# EAGLE design DiceMC-V1.0 (EAGLE 7.7.0)
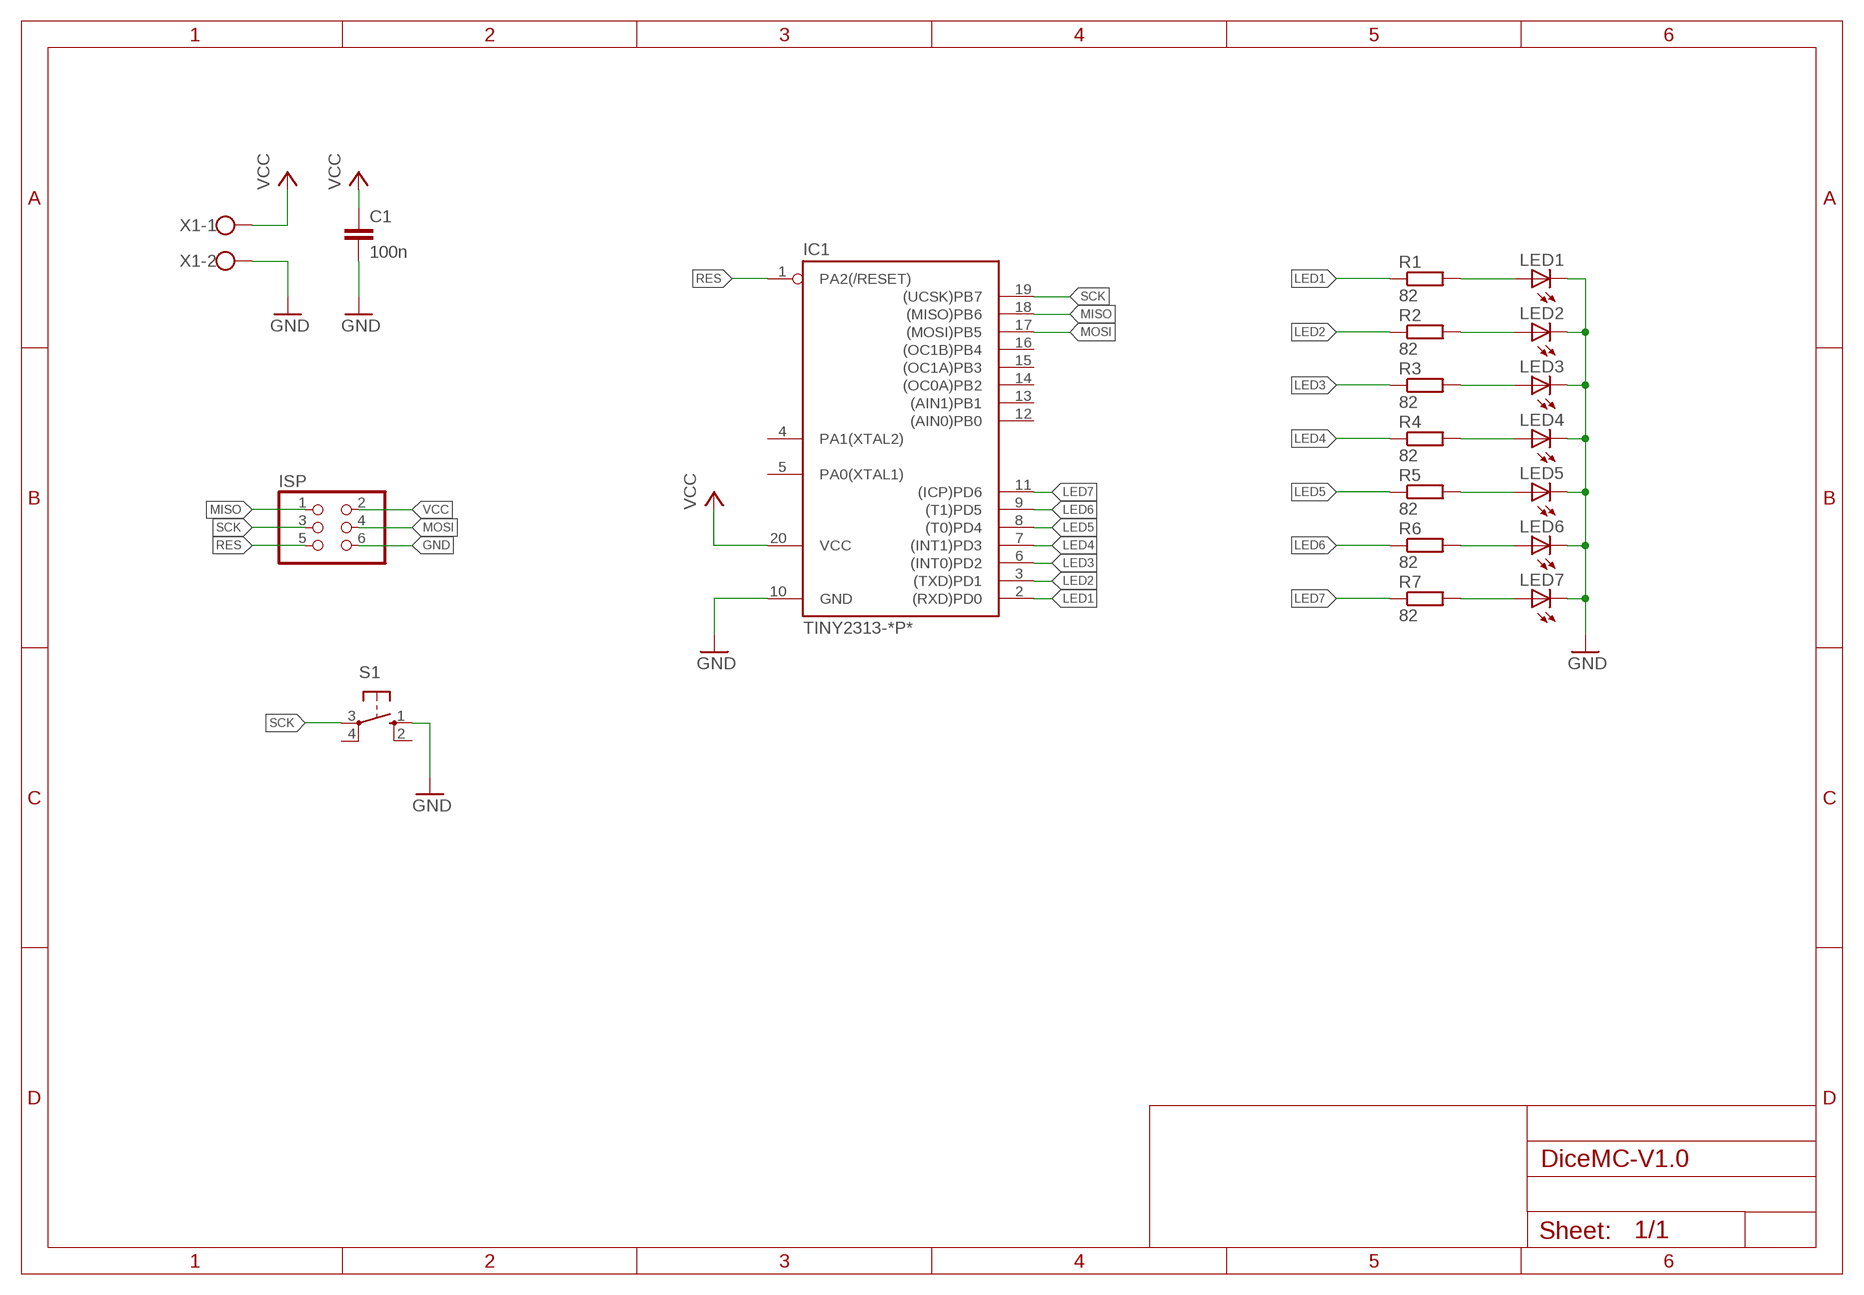
[diagram p0: schematic, sheet 1]

## Parts
C1  100n  C-EU025-025X050  [C025-025X050]
IC1  TINY2313-*P*  [DIL20]
ISP  PINHD-2X03_2.54  [2X03]
LED1  LED5MM  [LED5MM]
LED2  LED5MM  [LED5MM]
LED3  LED5MM  [LED5MM]
LED4  LED5MM  [LED5MM]
LED5  LED5MM  [LED5MM]
LED6  LED5MM  [LED5MM]
LED7  LED5MM  [LED5MM]
R1  82  R-EU_0207/7  [0207/7]
R2  82  R-EU_0207/7  [0207/7]
R3  82  R-EU_0207/7  [0207/7]
R4  82  R-EU_0207/7  [0207/7]
R5  82  R-EU_0207/7  [0207/7]
R6  82  R-EU_0207/7  [0207/7]
R7  82  R-EU_0207/7  [0207/7]
S1  10-XX  [B3F-10XX]
X1  W237-102  [W237-102]

## Nets
GND: C1.2 IC1.10(GND) ISP.6 LED1.K(C) LED2.K(C) LED3.K(C) LED4.K(C) LED5.K(C) LED6.K(C) LED7.K(C) S1.1(S) X1.2
LED1: IC1.2((RXD)PD0) R1.1
LED2: IC1.3((TXD)PD1) R2.1
LED3: IC1.6((INT0)PD2) R3.1
LED4: IC1.7((INT1)PD3) R4.1
LED5: IC1.8((T0)PD4) R5.1
LED6: IC1.9((T1)PD5) R6.1
LED7: IC1.11((ICP)PD6) R7.1
MISO: IC1.18((MISO)PB6) ISP.1
MOSI: IC1.17((MOSI)PB5) ISP.4
N$1: LED1.A R1.2
N$2: LED2.A R2.2
N$3: LED3.A R3.2
N$4: LED4.A R4.2
N$5: LED5.A R5.2
N$6: LED6.A R6.2
N$7: LED7.A R7.2
RES: IC1.1(PA2(/RESET)) ISP.5
SCK: IC1.19((UCSK)PB7) ISP.3 S1.3(P)
VCC: C1.1 IC1.20(VCC) ISP.2 X1.1
Unconnected: IC1.4(PA1(XTAL2)) IC1.5(PA0(XTAL1)) IC1.12((AIN0)PB0) IC1.13((AIN1)PB1) IC1.14((OC0A)PB2) IC1.15((OC1A)PB3) IC1.16((OC1B)PB4) S1.2(S1) S1.4(P1)

## Library data of the parts
C1 = rcl:C-EU: CAPACITOR, European symbol
IC1 = avr-7:TINY2313*: Atmel Tiny2313 2K Flash, 128 bytes EEPROM, 128 bytes RAM
ISP = pinhead-2:PINHD-2X03: PIN HEADER
LED1-LED7 = led:LED: LED OSRAM: - CHIPLED LG R971, LG N971, LY N971, LG Q971, LY Q971, LO R971, LY R971 LH N974, LH R974 LS Q976, LO Q976, LY Q976 LO Q996 - Hyper CHIPLED LW Q18S LB Q993, LB Q99A, LB R99A - SideLED LS A670, LO A670, LY A670, LG A670, LP A670 LB A673, LV A673, LT A673, LW A673 LH A674 LY A675 LS A676, LA A676, LO A676, LY A676, LW A676 LS A679, LY A679, LG A679 - Hyper Micro SIDELED® LS Y876, LA Y876, LO Y876, LY Y876 LT Y87S - SmartLED LW L88C, LW L88S LB L89C, LB L89S, LG L890 LS L89K, LO L89K, LY L89K LS L896, LA L896, LO L896, LY L896 - TOPLED LS T670, LO T670, LY T670, LG T670, LP T670 LSG T670, LSP T670, LSY T670, LOP T670, LYG T670 LG T671, LOG T671, LSG T671 LB T673, LV T673, LT T673, LW T673 LH T674 LS T676, LA T676, LO T676, LY T676, LB T676, LH T676, LSB T676, LW T676 LB T67C, LV T67C, LT T67C, LS T67K, LO T67K, LY T67K, LW E67C LS E67B, LA E67B, LO E67B, LY E67B, LB E67C, LV E67C, LT E67C LW T67C LS T679, LY T679, LG T679 LS T770, LO T770, LY T770, LG T770, LP T770 LB T773, LV T773, LT T773, LW T773 LH T774 LS E675, LA E675, LY E675, LS T675 LS T776, LA T776, LO T776, LY T776, LB T776 LHGB T686 LT T68C, LB T68C - Hyper Mini TOPLED® LB M676 - Mini TOPLED Santana® LG M470 LS M47K, LO M47K, LY M47K Source: http://www.osram.convergy.de LUXEON: - LUMILED® LXK2-PW12-R00, LXK2-PW12-S00, LXK2-PW14-U00, LXK2-PW14-V00 LXK2-PM12-R00, LXK2-PM12-S00, LXK2-PM14-U00 LXK2-PE12-Q00, LXK2-PE12-R00, LXK2-PE12-S00, LXK2-PE14-T00, LXK2-PE14-U00 LXK2-PB12-K00, LXK2-PB12-L00, LXK2-PB12-M00, LXK2-PB14-N00, LXK2-PB14-P00, LXK2-PB14-Q00 LXK2-PR12-L00, LXK2-PR12-M00, LXK2-PR14-Q00, LXK2-PR14-R00 LXK2-PD12-Q00, LXK2-PD12-R00, LXK2-PD12-S00 LXK2-PH12-R00, LXK2-PH12-S00 LXK2-PL12-P00, LXK2-PL12-Q00, LXK2-PL12-R00 Source: www.luxeon.com KINGBRIGHT: KA-3528ASYC Source: www.kingbright.com
R1-R7 = rcl:R-EU_: RESISTOR, European symbol
S1 = switch-omron:10-XX: OMRON SWITCH; MPN: B3F-1000; OC_FARNELL: 176432; OC_NEWARK: 36M3542
X1 = con-wago-500:W237-102: WAGO SCREW CLAMP; MPN: 237-102; OC_FARNELL: unknown; OC_NEWARK: 70K9898

## Board
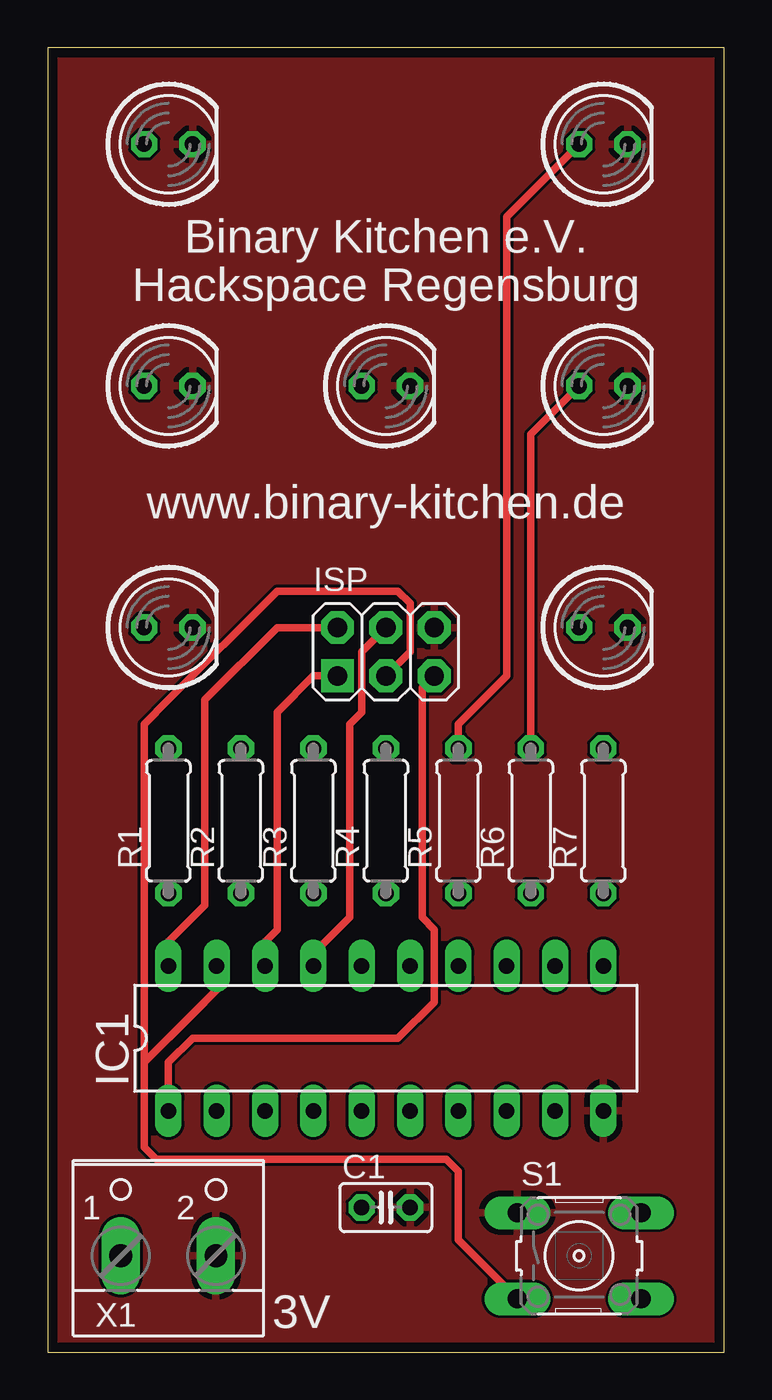
[diagram p1: board, top side]
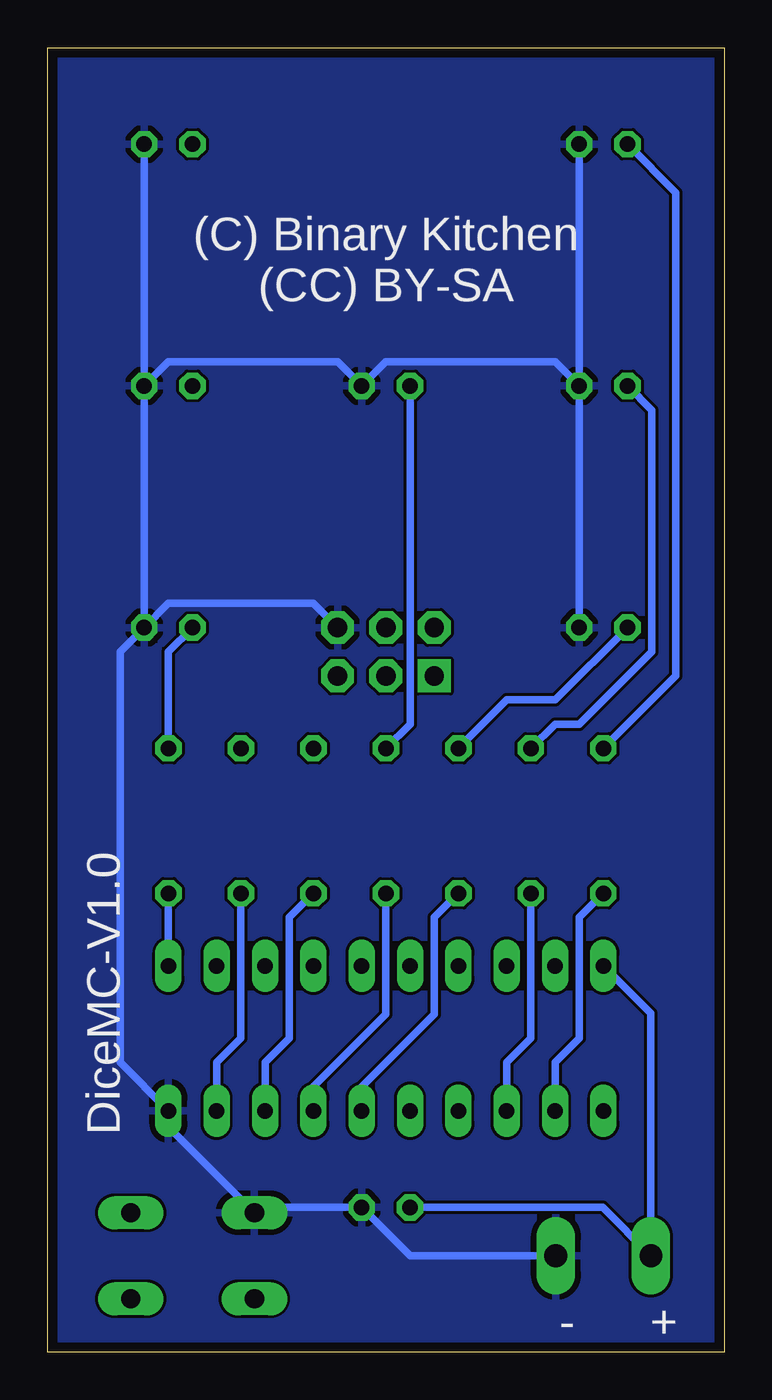
[diagram p2: board, bottom side, seen from below]

Size 35.56 x 68.58 mm. Coordinates in mm from the lower left corner, seen from the top.
Outline: 0,0 35.56,0 35.56,68.58 0,68.58 0,0
Copper layers (1*16): Top 0.035mm / dielectric 1.6mm / Bottom 0.035mm
Design rules "Elecrow_2-layer_PCB_eagle_rule *": minimum track width 6mil, minimum drill 12mil, track to track 6mil, track to pad 6mil, pad to pad 6mil, via to via 8mil, smd to smd 0mil, copper to edge 20mil, drill to drill 10mil, minimum pad ring 6mil, minimum via ring 6mil, stop-mask expansion 0mil, vias tented up to drill 100mil, thermal gap 12mil

### Footprints (pad centres in the part's own frame; a part is rotated, then mirrored left to right if it is on the bottom)
C025-025X050 = drill 0.813 octagon: 1 -1.27,0; 2 1.27,0
DIL20 = drill 0.813 long: 1 -11.43,-3.81; 2 -8.89,-3.81; 3 -6.35,-3.81; 4 -3.81,-3.81; 5 -1.27,-3.81; 6 1.27,-3.81; 7 3.81,-3.81; 8 6.35,-3.81; 9 8.89,-3.81; 10 11.43,-3.81; 11 11.43,3.81; 12 8.89,3.81; 13 6.35,3.81; 14 3.81,3.81; 15 1.27,3.81; 16 -1.27,3.81; 17 -3.81,3.81; 18 -6.35,3.81; 19 -8.89,3.81; 20 -11.43,3.81
2X03 = drill 1.016 square: 1 -2.54,-1.27 | drill 1.016 octagon: 2 -2.54,1.27; 3 0,-1.27; 4 0,1.27; 5 2.54,-1.27; 6 2.54,1.27
LED5MM = drill 0.813 octagon: A -1.27,0; K 1.27,0
0207/7 = drill 0.813 octagon: 1 -3.81,0; 2 3.81,0
B3F-10XX = drill 1.016 long: 1 -3.251,2.261; 2 3.251,2.261; 3 -3.251,-2.261; 4 3.251,-2.261
W237-102 = drill 1.194 long: 1 -2.5,-1.27; 2 2.5,-1.27

### Placement (x,y rotation side)
C1  17.78,7.62 0 top
IC1  17.78,16.51 0 top
ISP  17.78,36.83 0 top
LED1  6.35,63.5 0 top
LED2  6.35,50.8 0 top
LED3  6.35,38.1 0 top
LED4  17.78,50.8 0 top
LED5  29.21,63.5 0 top
LED6  29.21,50.8 0 top
LED7  29.21,38.1 0 top
R1  6.35,27.94 90 top
R2  10.16,27.94 90 top
R3  13.97,27.94 90 top
R4  17.78,27.94 90 top
R5  21.59,27.94 90 top
R6  25.4,27.94 90 top
R7  29.21,27.94 90 top
S1  27.94,5.08 0 top
X1  6.35,6.35 0 top

### Tracks (layer width: path | path; a pad name or v marks a point on that pad's centre or on a via)
GND
  Bottom 0.406: LED1.K LED2.K | LED5.K LED6.K | LED6.K LED7.K | LED2.K LED3.K | LED7.K 29.21,39.37 24.13,39.37 21.59,39.37 ISP.6 | LED6.K 29.21,52.07 24.13,52.07 20.32,52.07 LED4.K 17.78,52.07 12.7,52.07 8.89,52.07 LED2.K | LED7.K 31.75,36.83 31.75,27.94 31.75,15.24 IC1.10 29.21,11.86 S1.1 24.41,7.62 C1.2 16.51,5.08 X1.2
  pour Bottom: 0,68.58 35.56,68.58 35.56,0 0,0
  pour Top: 0,68.58 35.56,68.58 35.56,0 0,0
LED1
  Bottom 0.406: R1.1 7.62,22.86 7.62,16.51 8.89,15.24 IC1.2
LED2
  Bottom 0.406: R2.1 10.16,16.51 11.43,15.24 IC1.3
LED3
  Bottom 0.406: R3.1 15.24,22.86 15.24,17.78 19.05,13.97 IC1.6
LED4
  Bottom 0.406: R4.1 17.78,17.78 21.59,13.97 IC1.7
LED5
  Bottom 0.406: R5.1 22.86,22.86 22.86,16.51 24.13,15.24 IC1.8
LED6
  Bottom 0.406: R6.1 25.4,16.51 26.67,15.24 IC1.9
LED7
  Bottom 0.406: IC1.11 R7.1
MISO
  Top 0.406: IC1.18 11.43,21.59 12.06,22.23 12.06,33.66 13.97,35.56 ISP.1
MOSI
  Top 0.406: IC1.17 13.97,20.95 15.88,22.86 15.88,33.02 16.51,33.66 16.51,36.83 ISP.4
N$1
  Bottom 0.406: R1.2 2.54,35.56 2.54,50.8 2.54,60.96 LED1.A
N$2
  Bottom 0.406: LED2.A 3.81,49.53 3.81,41.91 3.81,36.83 7.62,33.02 8.89,33.02 R2.2
N$3
  Bottom 0.406: LED3.A 8.89,34.29 10.16,34.29 11.43,34.29 R3.2
N$4
  Bottom 0.406: LED4.A 16.51,33.02 R4.2
N$5
  Top 0.406: R5.2 21.59,33.02 24.13,35.56 24.13,59.69 LED5.A
N$6
  Top 0.406: R6.2 25.4,48.26 LED6.A
N$7
  Bottom 0.406: LED7.A 29.21,36.83 R7.2
RES
  Top 0.406: IC1.1 6.35,15.24 7.62,16.51 18.41,16.51 20.32,18.41 20.32,22.23 19.68,22.86 19.68,34.92 ISP.5
SCK
  Top 0.406: 8.89,19.05 IC1.19 8.89,19.05 | 8.89,19.05 7.62,17.78 5.08,15.24 | 5.08,15.24 5.08,10.79 5.71,10.16 20.95,10.16 21.59,9.53 21.59,5.92 S1.3 | 8.89,19.05 5.08,15.24 | 5.08,15.24 5.08,33.02 6.35,34.29 12.06,40.01 16.51,40.01 18.41,40.01 19.05,39.37 19.05,36.83 ISP.3
VCC
  Top 0.406: IC1.20 6.35,21.59 8.26,23.5 8.26,34.29 12.06,38.1 ISP.2
  Bottom 0.406: C1.1 6.39,7.62 X1.1 3.85,17.82 IC1.20

### Text on the board
tNames: Binary Kitchen e.V. | Hackspace Regensburg | www.binary-kitchen.de | 3V
bNames: (C) Binary Kitchen / (CC) BY-SA | DiceMC-V1.0 | + | -